# EAGLE design untitled (EAGLE 5.11)
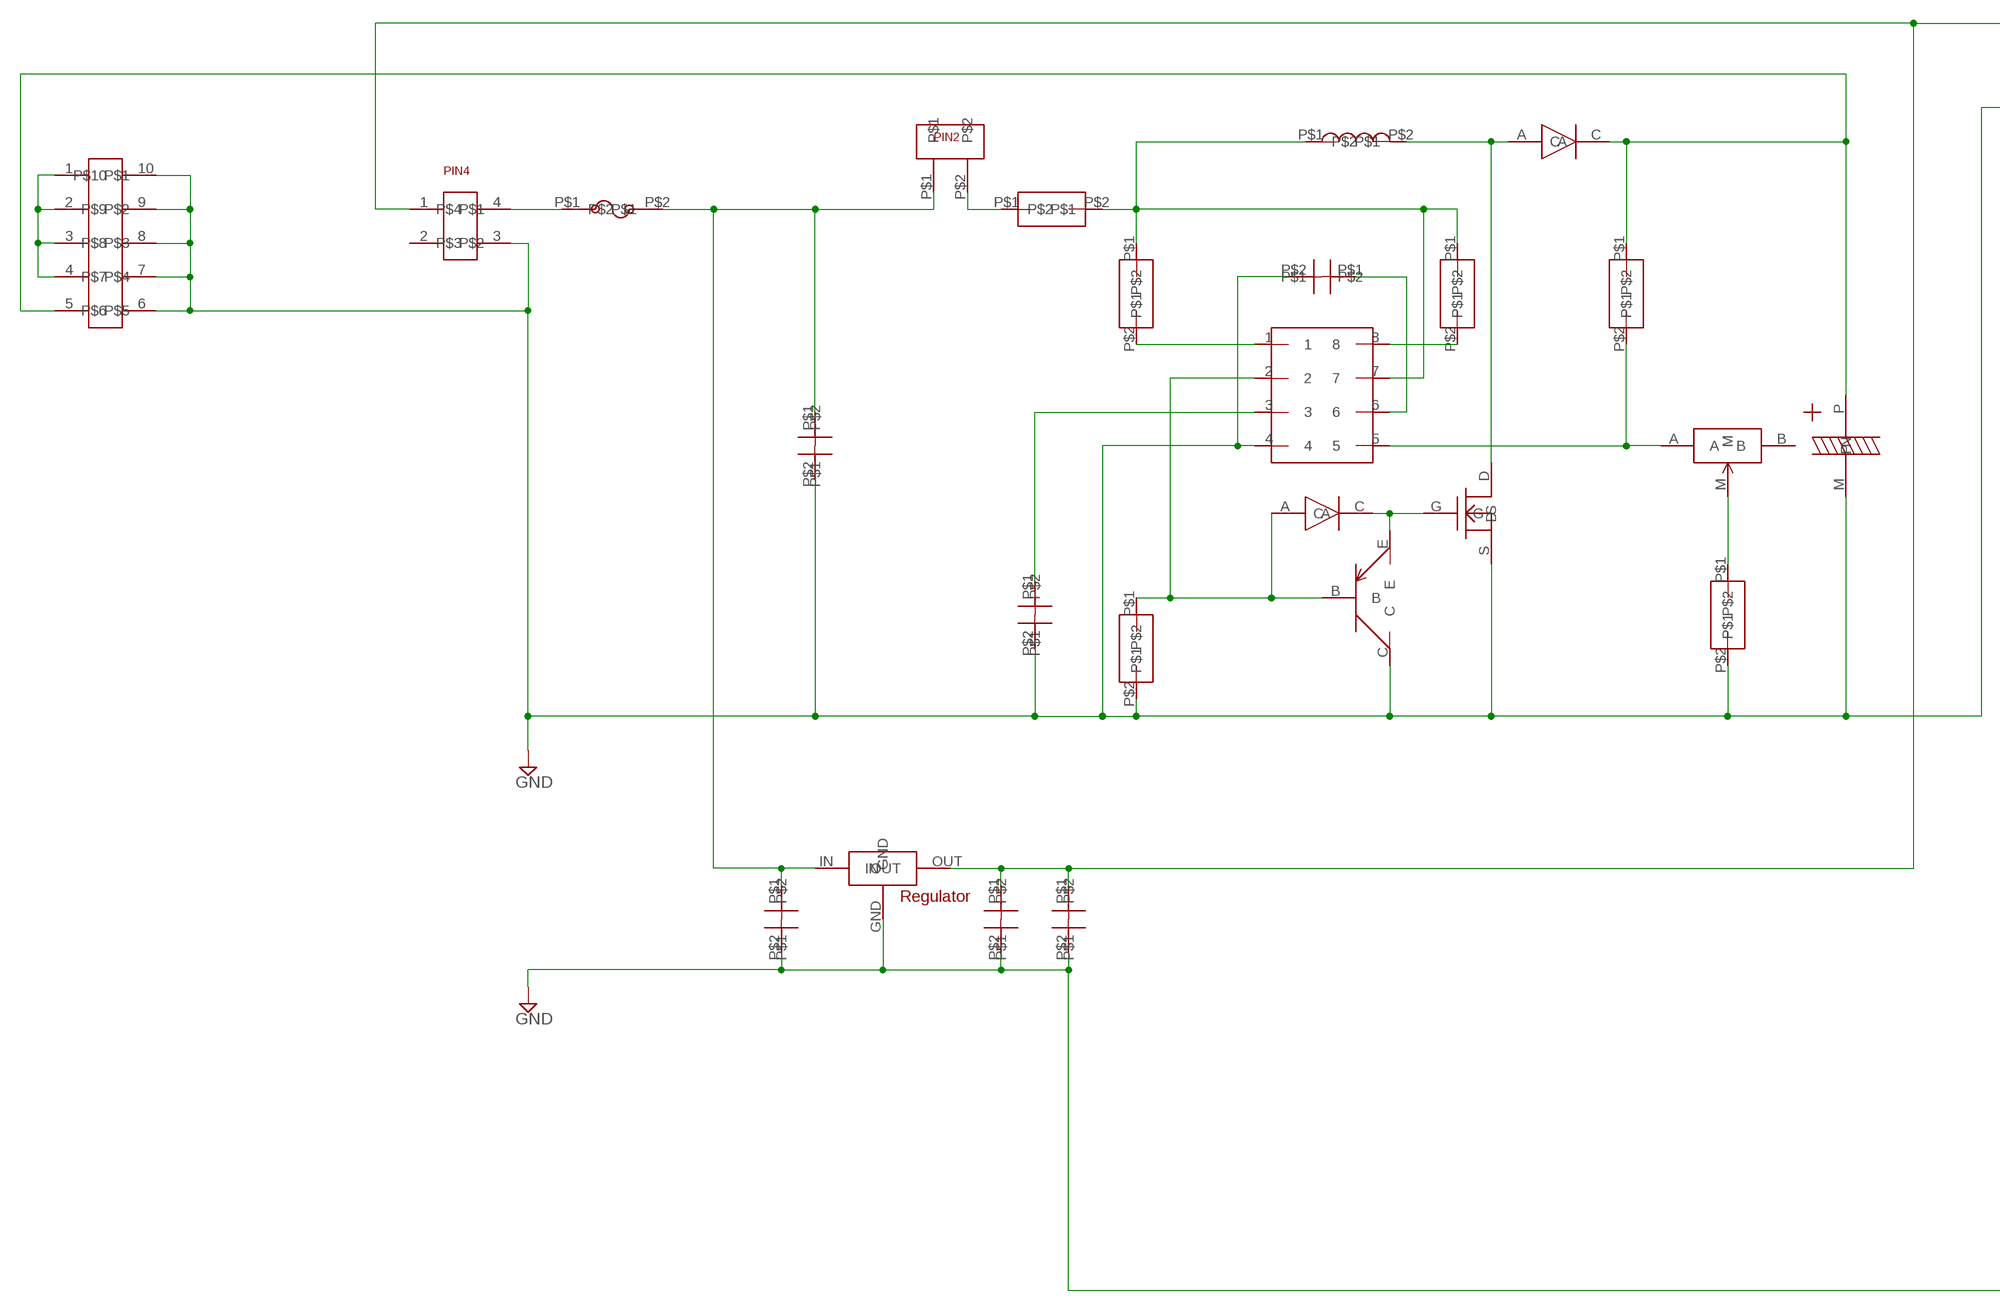
[diagram p0: schematic, sheet 1, part 1 of 2]
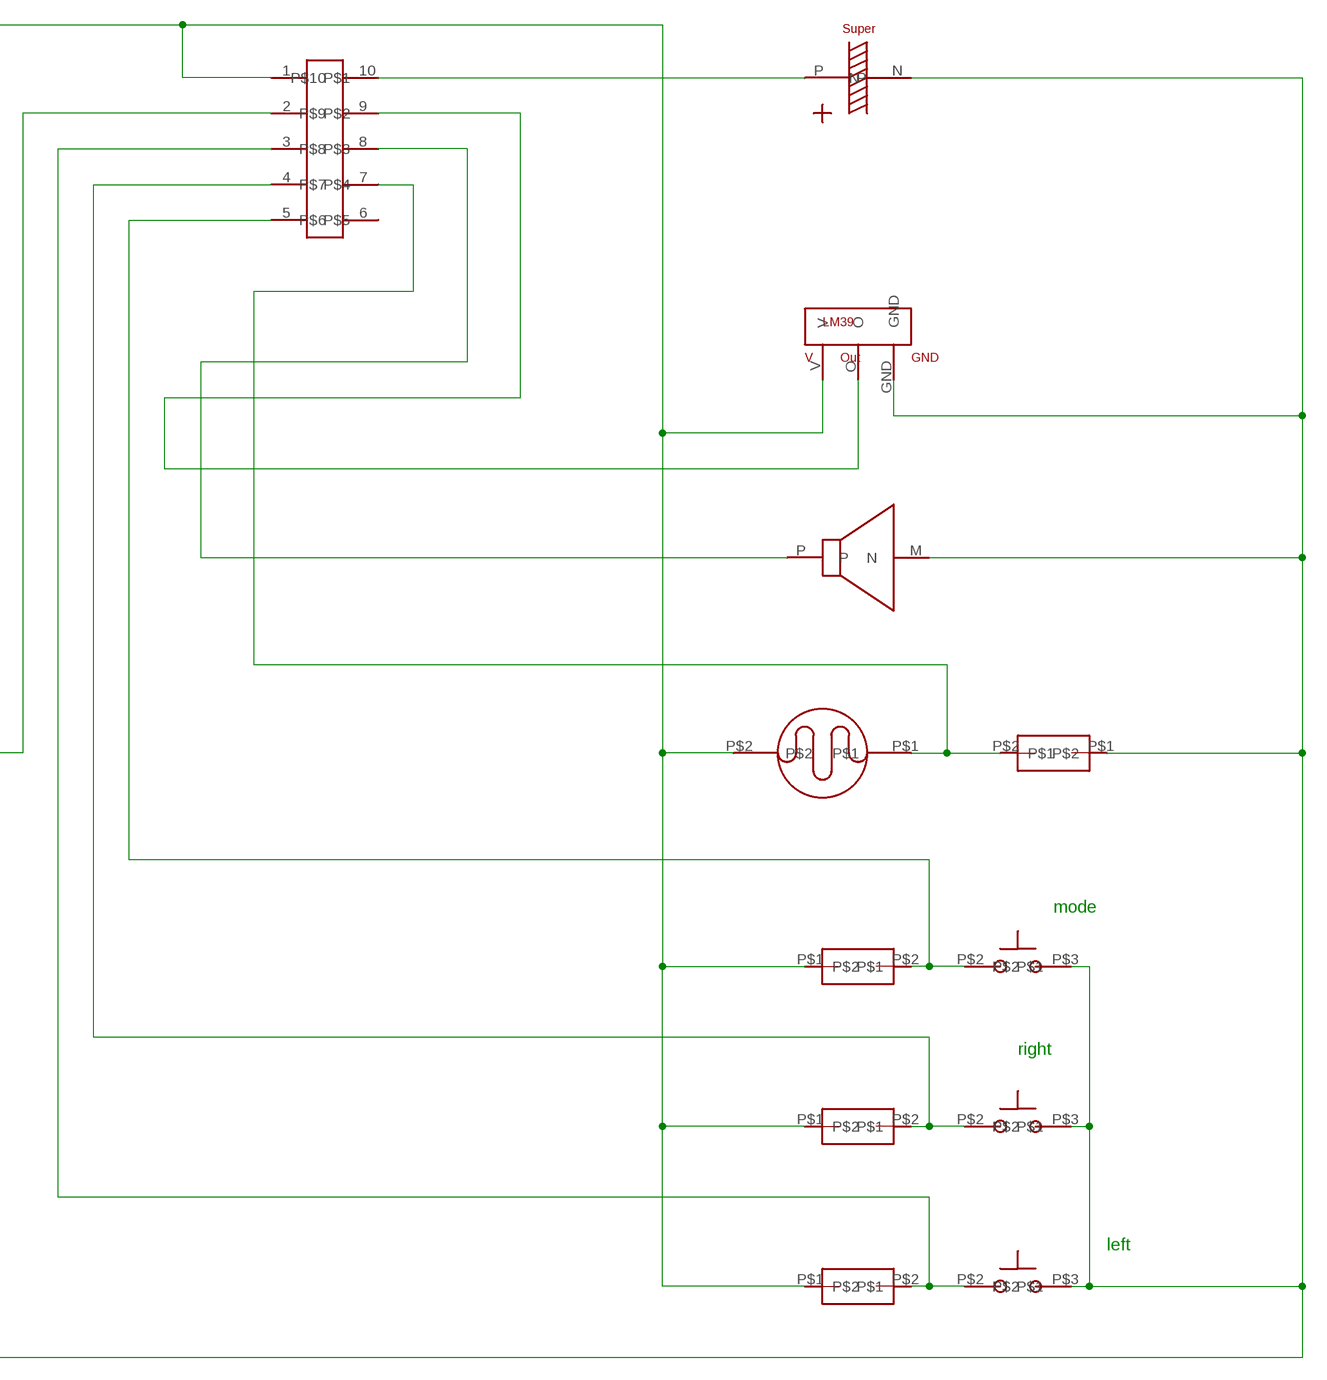
[diagram p1: schematic, sheet 1, part 2 of 2]

## Parts
U$1  REGISTOR_STAND  [REGISTOR_STAND]
U$2  REGISTOR_STAND  [REGISTOR_STAND]
U$3  REGISTOR_STAND  [REGISTOR_STAND]
U$4  REGISTOR_STAND  [REGISTOR_STAND]
U$5  RESISTOR_VALIABLE  [RESISTOR_VALIABLE]
U$6  REGISTOR_STAND  [REGISTOR_STAND]
U$7  FUSE  [FUSE]
U$8  CAPACITOR_SUPER_2  [CAPACITOR_SUPER_2]
U$9  DIP8  [DIP8]
U$10  COIL  [COIL]
U$11  CAPACITOR_LARGE2  [CAPACITOR_LEARGE2]
U$12  CAPACITOR  [CAPACITOR]
U$13  CAPACITOR  [CAPACITOR]
U$14  CAPACITOR  [CAPACITOR]
U$15  DIORDE  [DIORDE]
U$16  DIORDE  [DIORDE]
U$17  TRANSISTOR_PNP  [TRANSISTOR]
U$18  MOS_FET  [MOS_FET]
U$19  REGISTOR_STAND  [REGISTOR_STAND]
U$20  REGULATOR  [REGULATOR]
U$21  CAPACITOR  [CAPACITOR]
U$22  CAPACITOR  [CAPACITOR]
U$23  CAPACITOR  [CAPACITOR]
U$24  CDS  [CDS]
U$25  REGISTOR_STAND  [REGISTOR_STAND]
U$26  PIN4  [PIN4]
U$27  PIN2  [PIN2]
U$28  SPEAKER  [SPEAKER]
U$32  LM39  [LM39]
U$33  mode  SWITCH  [SWITCH]
U$34  left  SWITCH  [SWITCH]
U$35  right  SWITCH  [SWITCH]
U$36  REGISTOR_STAND  [REGISTOR_STAND]
U$37  REGISTOR_STAND  [REGISTOR_STAND]
U$38  REGISTOR_STAND  [REGISTOR_STAND]
U$39  PIN10  [PIN10]
U$40  PIN10  [PIN10]

## Nets
GND: U$2.P$2 U$4.P$2 U$8.N U$9.4 U$11.M(N) U$12.P$2 U$13.P$2 U$14.P$2 U$17.C U$18.S U$20.GND U$21.P$2 U$22.P$2 U$23.P$2 U$25.P$1 U$26.3 U$28.M(N) U$32.GND U$33.P$3 U$34.P$3 U$35.P$3 U$39.6 U$39.7 U$39.8 U$39.9 U$39.10 U$40.2
N$1: U$7.P$2 U$12.P$1 U$20.IN U$21.P$1 U$27.P$1
N$2: U$39.1 U$39.2 U$39.3 U$39.4
N$3: U$16.C U$17.E U$18.G
N$4: U$9.3 U$13.P$1
N$5: U$6.P$2 U$9.8
N$6: U$2.P$1 U$9.2 U$16.A U$17.B
N$7: U$4.P$1 U$5.M
N$8: U$3.P$2 U$5.A U$9.5
N$9: U$1.P$2 U$9.1
N$10: U$1.P$1 U$6.P$1 U$9.7 U$10.P$1 U$19.P$2
N$11: U$24.P$1 U$25.P$2 U$40.7
N$12: U$33.P$2 U$36.P$2 U$40.5
N$13: U$10.P$2 U$15.A U$18.D
N$14: U$9.6 U$14.P$1
N$15: U$19.P$1 U$27.P$2
N$16: U$3.P$1 U$11.P U$15.C U$39.5
N$17: U$32.O U$40.9
N$18: U$8.P U$40.10
N$19: U$35.P$2 U$37.P$2 U$40.4
N$20: U$34.P$2 U$38.P$2 U$40.3
N$21: U$7.P$1 U$26.4
N$23: U$20.OUT U$22.P$1 U$23.P$1 U$24.P$2 U$26.1 U$32.V U$36.P$1 U$37.P$1 U$38.P$1 U$40.1
N$24: U$28.P U$40.8
Unconnected: U$5.B U$26.2 U$40.6

## Notes on the sheet
- mode
- right
- left

## Library data of the parts
U$1-U$4 U$6 U$19 U$25 U$36-U$38 = mylib:REGISTOR_STAND
U$5 = mylib:RESISTOR_VALIABLE
U$7 = mylib:FUSE
U$8 = mylib:CAPACITOR_SUPER_2
U$9 = mylib:DIP8
U$10 = mylib:COIL
U$11 = mylib:CAPACITOR_LARGE2
U$12-U$14 U$21-U$23 = mylib:CAPACITOR
U$15 U$16 = mylib:DIORDE
U$17 = mylib:TRANSISTOR_PNP
U$18 = mylib:MOS_FET
U$20 = mylib:REGULATOR
U$24 = mylib:CDS
U$26 = mylib:PIN4
U$27 = mylib:PIN2
U$28 = mylib:SPEAKER
U$32 = mylib:LM39
U$33-U$35 = mylib:SWITCH
U$39 U$40 = mylib:PIN10

## Board
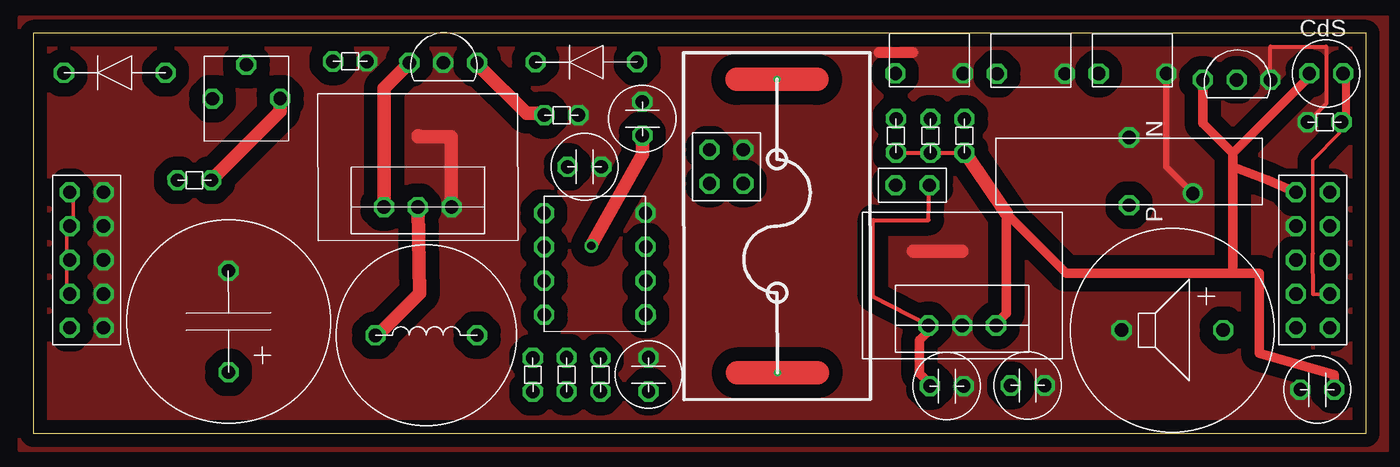
[diagram p2: board, top side]
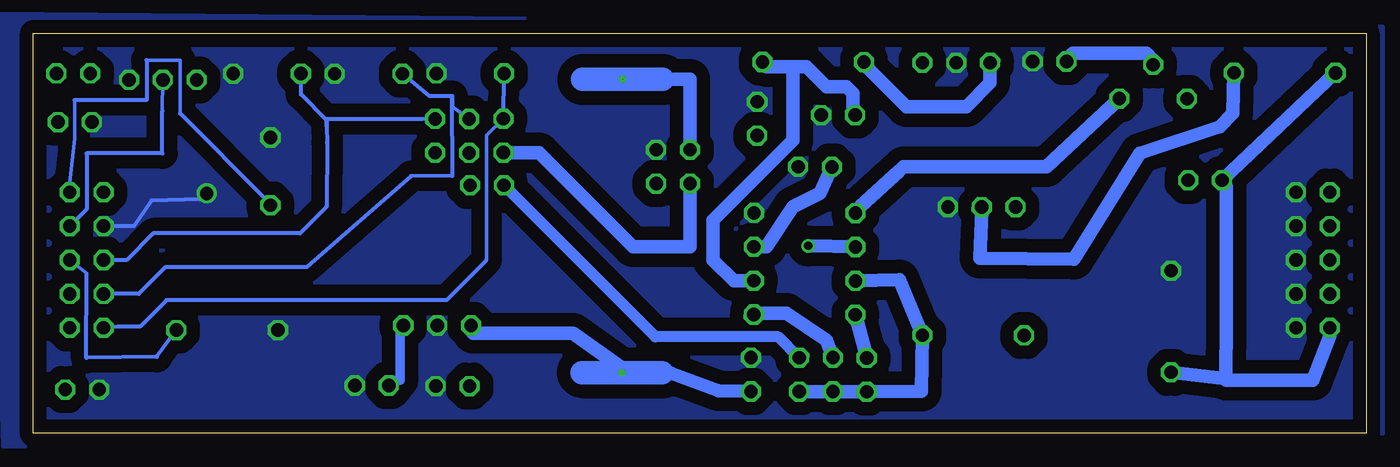
[diagram p3: board, bottom side, seen from below]

Size 100 x 30 mm. Coordinates in mm from the lower left corner, seen from the top.
Outline: 0,0 100,0 100,30 0,30 0,0
Copper layers (1*16): Top 0.035mm / dielectric 1.5mm / Bottom 0.035mm
Design rules "default": minimum track width 10mil, minimum drill 24mil, track to track 8mil, track to pad 8mil, pad to pad 8mil, via to via 8mil, smd to smd 8mil, copper to edge 40mil, drill to drill 8mil, minimum pad ring 10mil, minimum via ring 8mil, stop-mask expansion 4mil, vias tented up to drill 0mil, thermal gap 10mil

### Footprints (pad centres in the part's own frame; a part is rotated, then mirrored left to right if it is on the bottom)
REGISTOR_STAND = drill 1 octagon: P$1 -1.27,0; P$2 1.27,0
RESISTOR_VALIABLE = drill 1 octagon: A -2.54,0; B 2.54,0; M 0,-2.54
FUSE = drill 0.01 pad 0.01 round: P$1 -11,0; P$2 11,0
CAPACITOR_SUPER_2 = drill 1 octagon: N 2.54,0; P -2.54,0
DIP8 = drill 1 octagon: 1 -3.81,3.81; 2 -3.81,1.27; 3 -3.81,-1.27; 4 -3.81,-3.81; 5 3.81,-3.81; 6 3.81,-1.27; 7 3.81,1.27; 8 3.81,3.81
COIL = drill 1 octagon: P$1 3.81,0; P$2 -3.81,0
CAPACITOR_LEARGE2 = drill 1 octagon: M -3.81,0; P 3.81,0
CAPACITOR = drill 1 octagon: P$1 1.27,0; P$2 -1.27,0
DIORDE = drill 1 octagon: A -3.81,0; C 3.81,0
TRANSISTOR = drill 1 octagon: B 2.54,0; C 0,0; E -2.54,0
MOS_FET = drill 1 octagon: D 0,-2.5; G -2.54,-2.5; S 2.54,-2.5
REGULATOR = drill 1 octagon: GND 0,-2.5; IN -2.54,-2.5; OUT 2.54,-2.5
CDS = drill 1 octagon: P$1 -1.27,0; P$2 1.27,0
PIN4 = drill 1 octagon: 1 -1.27,1.27; 2 -1.27,-1.27; 3 1.27,-1.27; 4 1.27,1.27
PIN2 = drill 1 octagon: P$1 -1.27,0; P$2 1.27,0
SPEAKER = drill 1 octagon: M -3.81,0; P 3.81,0
LM39 = drill 1 octagon: GND 2.54,0; O 0,0; V -2.54,0
SWITCH = drill 1 octagon: P$2 -2.54,0; P$3 2.54,0
PIN10 = drill 1 octagon: 1 -1.27,5.08; 2 -1.27,2.54; 3 -1.27,0; 4 -1.27,-2.54; 5 -1.27,-5.08; 6 1.27,-5.08; 7 1.27,-2.54; 8 1.27,0; 9 1.27,2.54; 10 1.27,5.08

### Placement (x,y rotation side)
U$1  40.01,4.41 90.1 top
U$2  39.62,23.87 0.1 top
U$3  12.09,18.98 0.1 top
U$4  23.76,27.89 0.1 top
U$5  15.98,25.1 180.1 top
U$6  37.48,4.39 90.1 top
U$7  55.8,15.55 270.1 top
U$8  82.21,19.65 90 top
U$9  42.13,12.71 180.1 top
U$10  29.48,7.36 0.1 top
U$11  14.64,8.39 270.1 top
U$12  46.16,4.41 270.1 top
U$13  41.35,19.99 180.1 top
U$14  45.69,23.6 270.1 top
U$15  6.11,27.04 180.1 top
U$16  41.49,27.85 180.1 top
U$17  30.76,27.79 0.1 top
U$18  28.84,19.47 0.1 top
U$19  42.54,4.4 270.1 top
U$20  69.7,10.59 0 top
U$21  68.54,3.54 180 top
U$22  74.6,3.59 180 top
U$23  96.33,3.28 0 top
U$24  97,27 180 top
U$25  96.88,23.34 0 top
U$26  52,20 90 top
U$27  65.96,18.6 180 top
U$28  85.46,7.74 0 top
U$32  90.28,26.51 0 top
U$33  67.22,26.99 0 top
U$34  82.46,26.98 0 top
U$35  74.85,26.97 0 top
U$36  64.73,22.33 90 top
U$37  67.31,22.31 90 top
U$38  69.86,22.32 90 top
U$39  4,13 0 top
U$40  96,13 0 top

### Tracks (layer width: path | path; a pad name or v marks a point on that pad's centre or on a via)
GND  (via drill 1)
  Top 0.254: 63.47,28.58 63.48,28.52
  Top 0.305: U$32.GND 92.82,29 97,29 97,24.73 U$25.P$1
  Top 0.5: v87,18 85,20 U$34.P$3
  Top 0.813: 63.47,28.58 65.97,28.58
  Top 1: 66.04,13.67 69.67,13.67 | 28.86,22.32 28.86,22.26 31.36,22.26 31.36,17.01 arc90 U$18.S
  Bottom 0.305: U$40.2 92.46,15.54 91.16,17.46 87.46,17.54 v87,18
  pour Bottom (isolate 1.016, rank 6, no thermals): -1.27,30.48 103.28,31.48 102.28,-1 -1.27,0
  pour Top (isolate 1.016, rank 6, no thermals): -1,31.21 101.55,31.21 101.55,-1.27 -1,-1.27
N$1
  Top 0.254: U$20.IN 67,8
  Top 0.305: U$27.P$1 67.17,15.99 63,16 63,10.25 U$20.IN
  Top 0.7: 67,8 67,7.5 66.5,7 66.5,4.5 67,4 U$21.P$1
  Bottom 0.254: 56,5 U$7.P$2 55.5,5 52.5,5 52.16,4.5 | 67,7.5 U$20.IN | U$12.P$1 46.5,3.5 46.66,3.15
  Bottom 1.016: 56,5 59.5,7.5 67,7.5 | 46.66,3.15 48.59,3.19 52.16,4.5
N$2
  Top 0.254: 2.5,13 2.5,10.5 U$39.4 | U$39.1 3,18 3,16 U$39.2 2.5,15.5 2.5,13 | 2.5,13 U$39.3
N$3
  Top 1: U$18.G 26.31,25.88 U$17.E
  Bottom 0.254: 37.5,27.5 U$16.C
  Bottom 1: 30,24.5 28.22,26.28 U$17.E
  Bottom 1.016: 37.5,27.5 34.5,24.5 30,24.5
N$4
  Bottom 1: U$9.3 45.01,13.99 45,14 43,17 41,18 U$13.P$1
N$5
  Bottom 1.016: U$6.P$2 U$9.8
N$6
  Top 0.254: 33.5,27.5 U$17.B | U$2.P$1 38,24
  Top 1: 38,24 37,24
  Top 1.016: 37,24 33.5,27.5
  Bottom 0.254: 45,27.5 U$16.A
  Bottom 1: 43,27.5 42,27.5 40.5,26 39,26 38.5,25.5 38.5,24 U$2.P$1 | 43,27.5 45,27.5 | U$9.2 47.45,11.45 49,13 49,16 43,22 43,27.5
N$7
  Bottom 0.254: U$5.M 16,28 | 22.5,28 U$4.P$1
  Bottom 1.016: 16,28 16.5,28.5 22,28.5 22.5,28
N$8
  Top 1: U$3.P$2 18.52,24.15 U$5.A
  Bottom 0.254: U$9.5 38,16.5 38,17
  Bottom 1: 35.03,19.68 34.71,20 24,20 U$5.A
  Bottom 1.016: 35.03,19.68 38,17
N$9
  Bottom 0.254: 45.5,9 U$9.1
  Bottom 1: 43.5,9 45.5,9
  Bottom 1.016: 43.5,9 40.5,7 U$1.P$2
N$10
  Bottom 1.016: U$9.7 35.02,11.53 U$10.P$1 33.35,3.17 U$6.P$1 U$1.P$1 U$19.P$2
N$11
  Top 0.254: 96,13.5 96,20.5 98,22.5 98,23
  Top 0.305: 96,13.5 96.02,10.45 U$40.7
  Top 0.4: 98,23 U$25.P$2 98.5,23.5 | 98.5,27 U$24.P$1
  Top 0.61: 98.5,23.5 98.5,27
N$12
  Bottom 0.254: U$36.P$2 66,22.34 66,18.5 66,13
  Bottom 0.305: 94.5,8 U$40.5 93.65,8 92,8 90,10 69,10 66,13 | U$36.P$2 U$33.P$2
N$13
  Top 0.254: U$10.P$2 26,7.5 | 28.89,16.8 U$18.D
  Top 1.016: 26,7.5 29,10.5 28.89,16.8
  Bottom 0.254: 28.83,16.77 29.33,16.77 U$18.D | U$15.A 10,27
  Bottom 1: 21.93,13.06 17,21 11,23 10,24 U$15.A
  Bottom 1.016: 21.93,13.06 28.97,13.12 28.83,16.77
N$14  (via drill 0.61)
  Top 0.254: 45.7,22.04 45.5,22 U$14.P$1
  Top 1: v41.86,14.06 45.7,20.92 45.7,22.04
  Bottom 0.254: 38.28,13.98 38.5,14 U$9.6
  Bottom 1: 38.28,13.98 v41.86,14.06
N$15
  Bottom 0.813: U$19.P$1 44.1,7.23 53.32,7.23 U$27.P$2
N$16
  Bottom 0.254: 10.5,18.5 U$3.P$1
  Bottom 1: 10.54,4.08 U$11.P | 10.54,4.08 10.5,4 4,4 2.73,7.27 U$39.5 | 10.54,4.08 10.5,8.5
  Bottom 1.016: 10.5,8.5 10.5,18.5 | U$3.P$1 U$15.C
N$17
  Bottom 0.254: 90.32,24.17 U$32.O
  Bottom 0.305: U$40.9 96,16.81 96,21 90.32,21 90.32,24.17
N$18
  Bottom 0.254: 89,24 89,28 91.5,28 | U$8.P 82.5,17.5 | 96.9,25 96.9,22.14 97.27,18.78
  Bottom 0.305: 82.5,17.5 89,24 | 97.3,18.2 U$40.10 97.27,18.78 | 91.5,28 91.5,25 96.9,25
N$19
  Bottom 0.305: U$40.4 92.09,10.46 90.09,12.45 79.54,12.46 79.48,12.46 71.66,19.3 68.56,19.32 68.58,25.29 | 68.58,25.29 70.27,25.29 U$35.P$2 | 68.58,25.29 68.58,24.52 U$37.P$2
N$20
  Bottom 0.305: U$38.P$2 70.83,23.57 77.99,23.57 77.99,23 | U$40.3 93,13 91,15 80,15 78,17 77.96,21.81 77.99,23 | 77.99,23 78,23.5 79.92,25.42 U$34.P$2
N$21
  Bottom 1.016: U$26.4 50.73,26.55 U$7.P$1
N$23
  Top 0.254: U$24.P$2 95.5,27
  Top 0.305: U$36.P$1 64.73,21.04 U$37.P$1 70,21.04 70,21 69.86,21 U$38.P$1
  Top 0.7: U$20.OUT 72.5,8.5 73,9 73,16.5 77.5,12 90,12 | 90,20 90,21 | 90,21 95.73,26.73 U$24.P$2 | U$40.1 92.65,19 90,20 | U$32.V 87.74,23.26 90,21 | U$23.P$1 97.6,4.4 92,6 92,12 90,12 | 90,12 90,20
  Top 1: 73,16.5 70.01,20.88 U$38.P$1
  Bottom 0.254: U$20.OUT 72.5,8
  Bottom 0.7: 72.5,8 72.5,4 73,4 U$22.P$1
  Bottom 1.016: U$26.1 50.73,14 55,14 62.05,21.05 U$36.P$1
N$24
  Bottom 0.254: 96,12 U$40.8
  Bottom 0.305: U$28.P 90.74,5.74 96.02,5.67 96,12